# Altium schematic sheet RS485.SchDoc
size A4; SheetNumber: 4; SheetTotal: 8
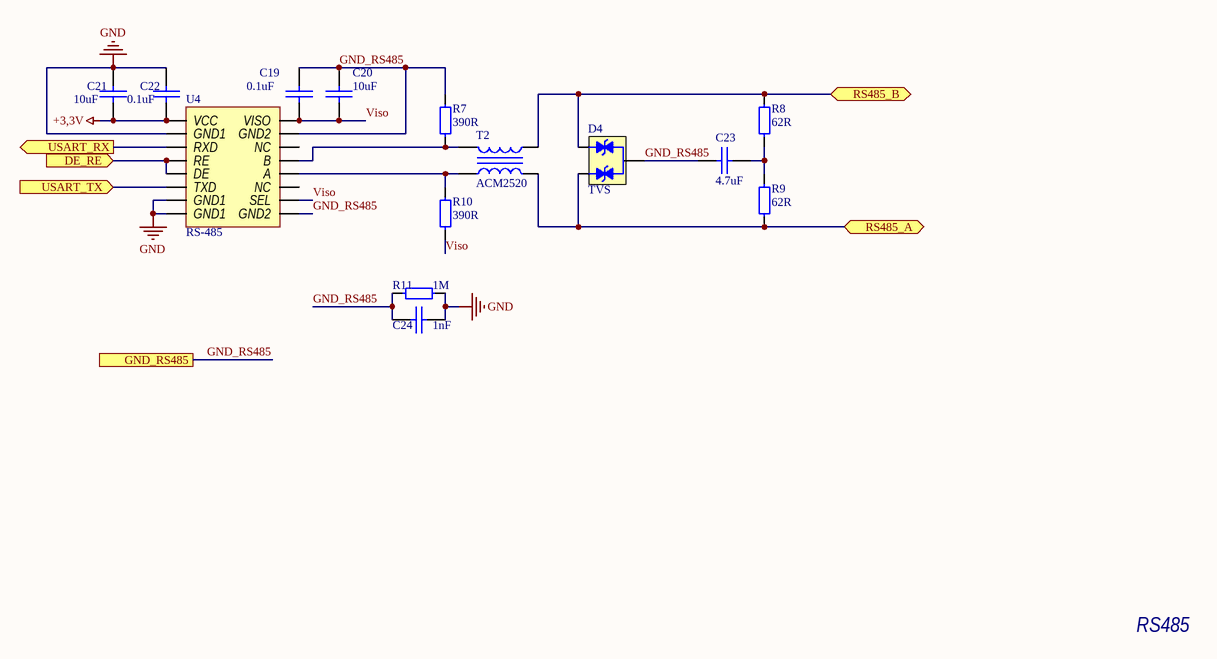
[diagram p0: RS485.SchDoc]

## Parts
C19  0.1uF  [0603 Capicator]
C20  10uF  [0603 Capicator]
C21  10uF  [0603 Capicator]
C22  0.1uF  [0603 Capicator]
C23  4.7uF  [0603 Capicator]
C24  1nF  [0603 Capicator]
D4  TVS  [SOT-23]
R7  390R  [1206 RESISTOR]
R8  62R  [0603 Resistor]
R9  62R  [0603 Resistor]
R10  390R  [1206 RESISTOR]
R11  1M  [0603 Resistor]
T2  ACM2520  [ACM2520]
U4  RS-485  [SOIC16W]

## Ports
DE_RE (in), GND_RS485, RS485_A (bidir), RS485_B (bidir), USART_RX (out), USART_TX (in)

## Nets
+3,3V: C21.2 C22.1 U4.1(VCC)
GND: C21.1 C22.2 C24.2 R11.2 U4.2(GND1) U4.7(GND1) U4.8(GND1)
DE_RE: U4.4(RE) U4.5(DE) ; port DE_RE
GND_RS485: C19.2 C20.2 C23.2 C24.1 D4.3 R7.2 R11.1 U4.9(GND2) U4.15(GND2) ; port GND_RS485
RS485_A: D4.2 R9.1 T2.4 ; port RS485_A
RS485_B: D4.1 R8.2 T2.2 ; port RS485_B
USART_RX: U4.3(RXD) ; port USART_RX
USART_TX: U4.6(TXD) ; port USART_TX
Viso: C19.1 C20.1 R10.1 U4.10(SEL) U4.16(VISO)
NetC23_1: C23.1 R8.1 R9.2
NetR7_1: R7.1 T2.1 U4.13(B)
NetR10_2: R10.2 T2.3 U4.12(A)

Not connected (* = marked no-connect by the designer): U4 11(NC) 14(NC)

## Notes on the sheet
- RS485

## Library data of the parts
C19 C22 = Cap 0.1uF (0603): 0.1uF X7R 16V 10% 0603; Manufacturer: Murata Manufacturing; Part Number: GRM188R71C104KA01D; Type: Capacitor; ComponentLink1Description: Chip&Dip; ComponentLink1URL: https://www.chipdip.ru/product/grm188r71c104ka01d
C20 C21 = Cap 10uF (0603): 10uF X5R 25V 20% 0603; Manufacturer: Murata Manufacturing; Part Number: GRM188R61E106M; Type: Capacitor; ComponentLink1Description: Chip&Dip; ComponentLink1URL: https://www.chipdip.ru/product/grm188r61e106m
C23 = Cap 4.7uF (0603): 4.7uF X5R 25V 10% 0603; Manufacturer: Murata Manufacturing; Part Number: GRM188R61E475KE11D; Type: Capacitor; ComponentLink1Description: Chip&Dip; ComponentLink1URL: https://www.chipdip.ru/product0/9000348448
C24 = Cap 1nF (0603): X7R 1nF 100V 10% 0603; Manufacturer: Murata Manufacturing; Part Number: GRM188R72A102KA01D; Type: Capacitor; ComponentLink1Description: Chip&Dip; ComponentLink1URL: https://www.chipdip.ru/product/grm188r72a102ka01d
D4 = TVS Diode Arrays: The SM24CANB TVS Diode Array is designed to protect automotive Controller Area Network (CAN) lines from damage due to electrostatic discharge (ESD), electrical fast transient (EFT), and other overvoltage transients.; Part Number: SM24CANB-02HTG; Manufacturer: Littelfuse; Type: Diode; ComponentLink1Description: DataSheet; ComponentLink1URL: https://m.littelfuse.com/~/media/electronics/datasheets/tvs_diode_arrays/littelfuse_tvs_diode_array_sm24canb_datasheet.pdf.pdf; ComponentLink2Description: Chip&Dip; ComponentLink2URL: https://www.chipdip.ru/product1/8001779022
R7 R10 = Res 390R (1206): 0.25W 1206 390R; Part Number: RC1206JR-07390KL; Manufacturer: Taiwan; Type: Resistor; ComponentLink1Description: Chip&Dip; ComponentLink1URL: https://www.chipdip.ru/product0/8023504304
R8 R9 = Res 62R (0603): 0.1W 0603 62R, 1%; Part Number: RC0603FR-0762RL; Manufacturer: Taiwan; Type: Resistor; ComponentLink1Description: Chip&Dip; ComponentLink1URL: https://www.chipdip.ru/product0/9000079611
R11 = Res 1M (0603): 0.1W 0603 1M, 1%; Part Number: RC0603FR-071ML; Manufacturer: Taiwan; Type: Resistor; ComponentLink1Description: Chip&Dip; ComponentLink1URL: https://www.chipdip.ru/product0/9000079784
T2 = ACM2520: Common mode filters / Automotive signal line (for power train/safety); Manufacturer: TDK; Part Number: ACM2520-301-2P-T002; Type: Inductor; ComponentLink1Description: DataSheet; ComponentLink1URL: https://product.tdk.com/system/files/dam/doc/product/emc/emc/cmf_cmc/catalog/cmf_commercial_signal_acm2520_en.pdf; ComponentLink2Description: ChipDip; ComponentLink2URL: https://www.chipdip.ru/product0/8008480337?ysclid=lw4t4jsj9a923851487
U4 = TDA51S485HC: Isolated RS-485 Half-Duplex tranciever; Manufacturer: Mornsun; Type: IC; Part Number: TDA51S485HC; ComponentLink1Description: ChipDip; ComponentLink1URL: https://www.chipdip.ru/product0/8009281357; ComponentLink2Description: Datasheet; ComponentLink2URL: https://www.mornsun-power.com/html/pdf/TDA51S485HC.html